# Altium schematic sheet 1_MCU.SchDoc
size A4; SheetNumber: 1; SheetTotal: 5
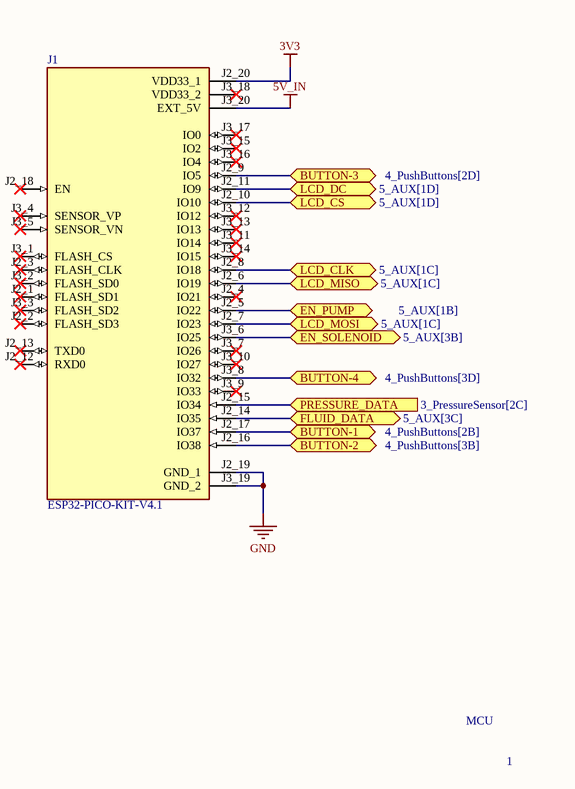
[diagram p0: 1_MCU.SchDoc]

## Parts
J1  ESP32-PICO-KIT-V4.1  [XCVR_ESP32-PICO-KIT-V4.1]

## Ports
BUTTON-1 (bidir, see 4_PushButtons[2B]), BUTTON-2 (bidir, see 4_PushButtons[3B]), BUTTON-3 (bidir, see 4_PushButtons[2D]), BUTTON-4 (bidir, see 4_PushButtons[3D]), EN_PUMP (bidir, see 5_AUX[1B]), EN_SOLENOID (bidir, see 5_AUX[3B]), FLUID_DATA (bidir, see 5_AUX[3C]), LCD_CLK (bidir, see 5_AUX[1C]), LCD_CS (bidir, see 5_AUX[1D]), LCD_DC (bidir, see 5_AUX[1D]), LCD_MISO (bidir, see 5_AUX[1C]), LCD_MOSI (bidir, see 5_AUX[1C]), PRESSURE_DATA (in, see 3_PressureSensor[2C])

## Nets
3V3: J1.J2_20(VDD33_1)
5V_IN: J1.J3_20(EXT_5V)
GND: J1.J2_19(GND_1) J1.J3_19(GND_2)
BUTTON-1: J1.J2_17(IO37) ; port BUTTON-1
BUTTON-2: J1.J2_16(IO38) ; port BUTTON-2
BUTTON-3: J1.J2_9(IO5) ; port BUTTON-3
BUTTON-4: J1.J3_8(IO32) ; port BUTTON-4
EN_PUMP: J1.J2_5(IO22) ; port EN_PUMP
EN_SOLENOID: J1.J3_6(IO25) ; port EN_SOLENOID
FLUID_DATA: J1.J2_14(IO35) ; port FLUID_DATA
LCD_CLK: J1.J2_8(IO18) ; port LCD_CLK
LCD_CS: J1.J2_10(IO10) ; port LCD_CS
LCD_DC: J1.J2_11(IO9) ; port LCD_DC
LCD_MISO: J1.J2_6(IO19) ; port LCD_MISO
LCD_MOSI: J1.J2_7(IO23) ; port LCD_MOSI
PRESSURE_DATA: J1.J2_15(IO34) ; port PRESSURE_DATA

Not connected (* = marked no-connect by the designer): J1 J2_1(FLASH_SD1)* J2_2(FLASH_SD3)* J2_3(FLASH_CLK)* J2_4(IO21)* J2_12(RXD0)* J2_13(TXD0)* J2_18(EN)* J3_1(FLASH_CS)* J3_2(FLASH_SD0)* J3_3(FLASH_SD2)* J3_4(SENSOR_VP)* J3_5(SENSOR_VN)* J3_7(IO26)* J3_9(IO33)* J3_10(IO27)* J3_11(IO14)* J3_12(IO12)* J3_13(IO13)* J3_14(IO15)* J3_15(IO2)* J3_16(IO4)* J3_17(IO0)* J3_18(VDD33_2)*

## Notes on the sheet
- MCU
- 1

## Library data of the parts
J1 = CMP-003-000001-1: WiFi Development Tools (802.11); MF: Espressif Systems; Availability: Bad; Value: *; Source: ESP32-PICO-KIT-V4.1.SchLib; Check_prices: https://www.snapeda.com/parts/ESP32-PICO-KIT-V4.1/Espressif%20Systems/view-part/3211113/?ref=eda; MP: ESP32-PICO-KIT-V4.1; Component Type: Standard; Price: None; SnapEDA_Link: https://www.snapeda.com/parts/ESP32-PICO-KIT-V4.1/Espressif%20Systems/view-part/3211113/?ref=snap; Design Item ID: ESP32-PICO-KIT-V4.1; Pin Count: 40; Package: None